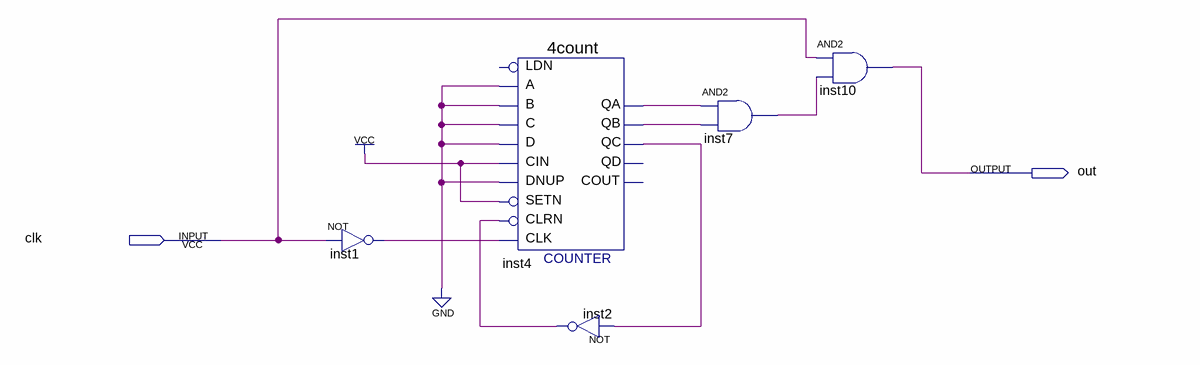
[diagram p0: schematic sheet]
// Quartus schematic Block2.bdf as structural Verilog: 5 symbols, 2 pins
module Block2 (
  input  clk,
  output out
);

  wire inst1_out, inst2_out, inst4_qa, inst4_qb, inst4_qc, inst7_out;

  not inst1 (inst1_out, clk);
  \4count  inst4 (
    .B(1'b0), .A(1'b0), .D(1'b0), .CIN(1'b1), .DNUP(1'b0), .CLK(inst1_out), .SETN(1'b1), .C(1'b0),
    .CLRN(inst2_out), .QA(inst4_qa), .QB(inst4_qb), .QC(inst4_qc));  // open: LDN, QD, COUT
  not inst2 (inst2_out, inst4_qc);
  and inst7 (inst7_out, inst4_qa, inst4_qb);
  and inst10 (out, clk, inst7_out);
endmodule
